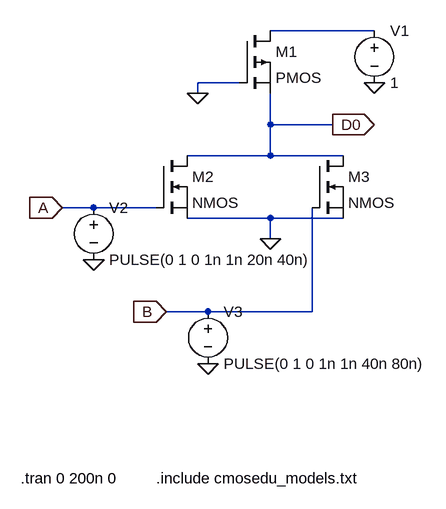
[diagram p0: schematic exp 8.asc]
exp 8.asc, the LTspice schematic file:
Version 4
SHEET 1 932 704
WIRE -80 0 -240 0
WIRE -288 80 -352 80
WIRE -352 96 -352 80
WIRE -240 144 -240 96
WIRE -144 144 -240 144
WIRE -240 192 -240 144
WIRE -240 192 -368 192
WIRE -128 192 -240 192
WIRE -512 272 -560 272
WIRE -416 272 -512 272
WIRE -240 288 -368 288
WIRE -128 288 -240 288
WIRE -240 320 -240 288
WIRE -336 432 -400 432
WIRE -176 432 -176 272
WIRE -176 432 -336 432
FLAG -352 96 0
FLAG -240 320 0
FLAG -80 80 0
FLAG -560 272 A
IOPIN -560 272 In
FLAG -400 432 B
IOPIN -400 432 In
FLAG -512 352 0
FLAG -336 512 0
FLAG -144 144 D0
IOPIN -144 144 Out
SYMBOL pmos -288 0 R0
SYMATTR InstName M1
SYMBOL nmos -416 192 R0
SYMATTR InstName M2
SYMBOL nmos -176 192 R0
SYMATTR InstName M3
SYMBOL voltage -80 -16 R0
WINDOW 123 0 0 Left 0
WINDOW 39 0 0 Left 0
SYMATTR InstName V1
SYMATTR Value 1
SYMBOL voltage -512 256 R0
WINDOW 123 0 0 Left 0
WINDOW 39 0 0 Left 0
SYMATTR InstName V2
SYMATTR Value PULSE(0 1 0 1n 1n 20n 40n)
SYMBOL voltage -336 416 R0
WINDOW 123 0 0 Left 0
WINDOW 39 0 0 Left 0
SYMATTR InstName V3
SYMATTR Value PULSE(0 1 0 1n 1n 40n 80n)
TEXT -624 688 Left 2 !.tran 0 200n 0
TEXT -416 688 Left 2 !.include cmosedu_models.txt

The netlist it stands for:
* exp 8.asc
M1 N001 0 D0 D0 PMOS
M2 D0 A 0 0 NMOS
M3 D0 B 0 0 NMOS
V1 N001 0 1
V2 A 0 PULSE(0 1 0 1n 1n 20n 40n)
V3 B 0 PULSE(0 1 0 1n 1n 40n 80n)
.model NMOS NMOS
.model PMOS PMOS
.lib standard.mos
.tran 0 200n 0
.include cmosedu_models.txt
.backanno
.end